# EAGLE design TREM_STM_DAUGHTERBOARD (EAGLE 9.2.2)
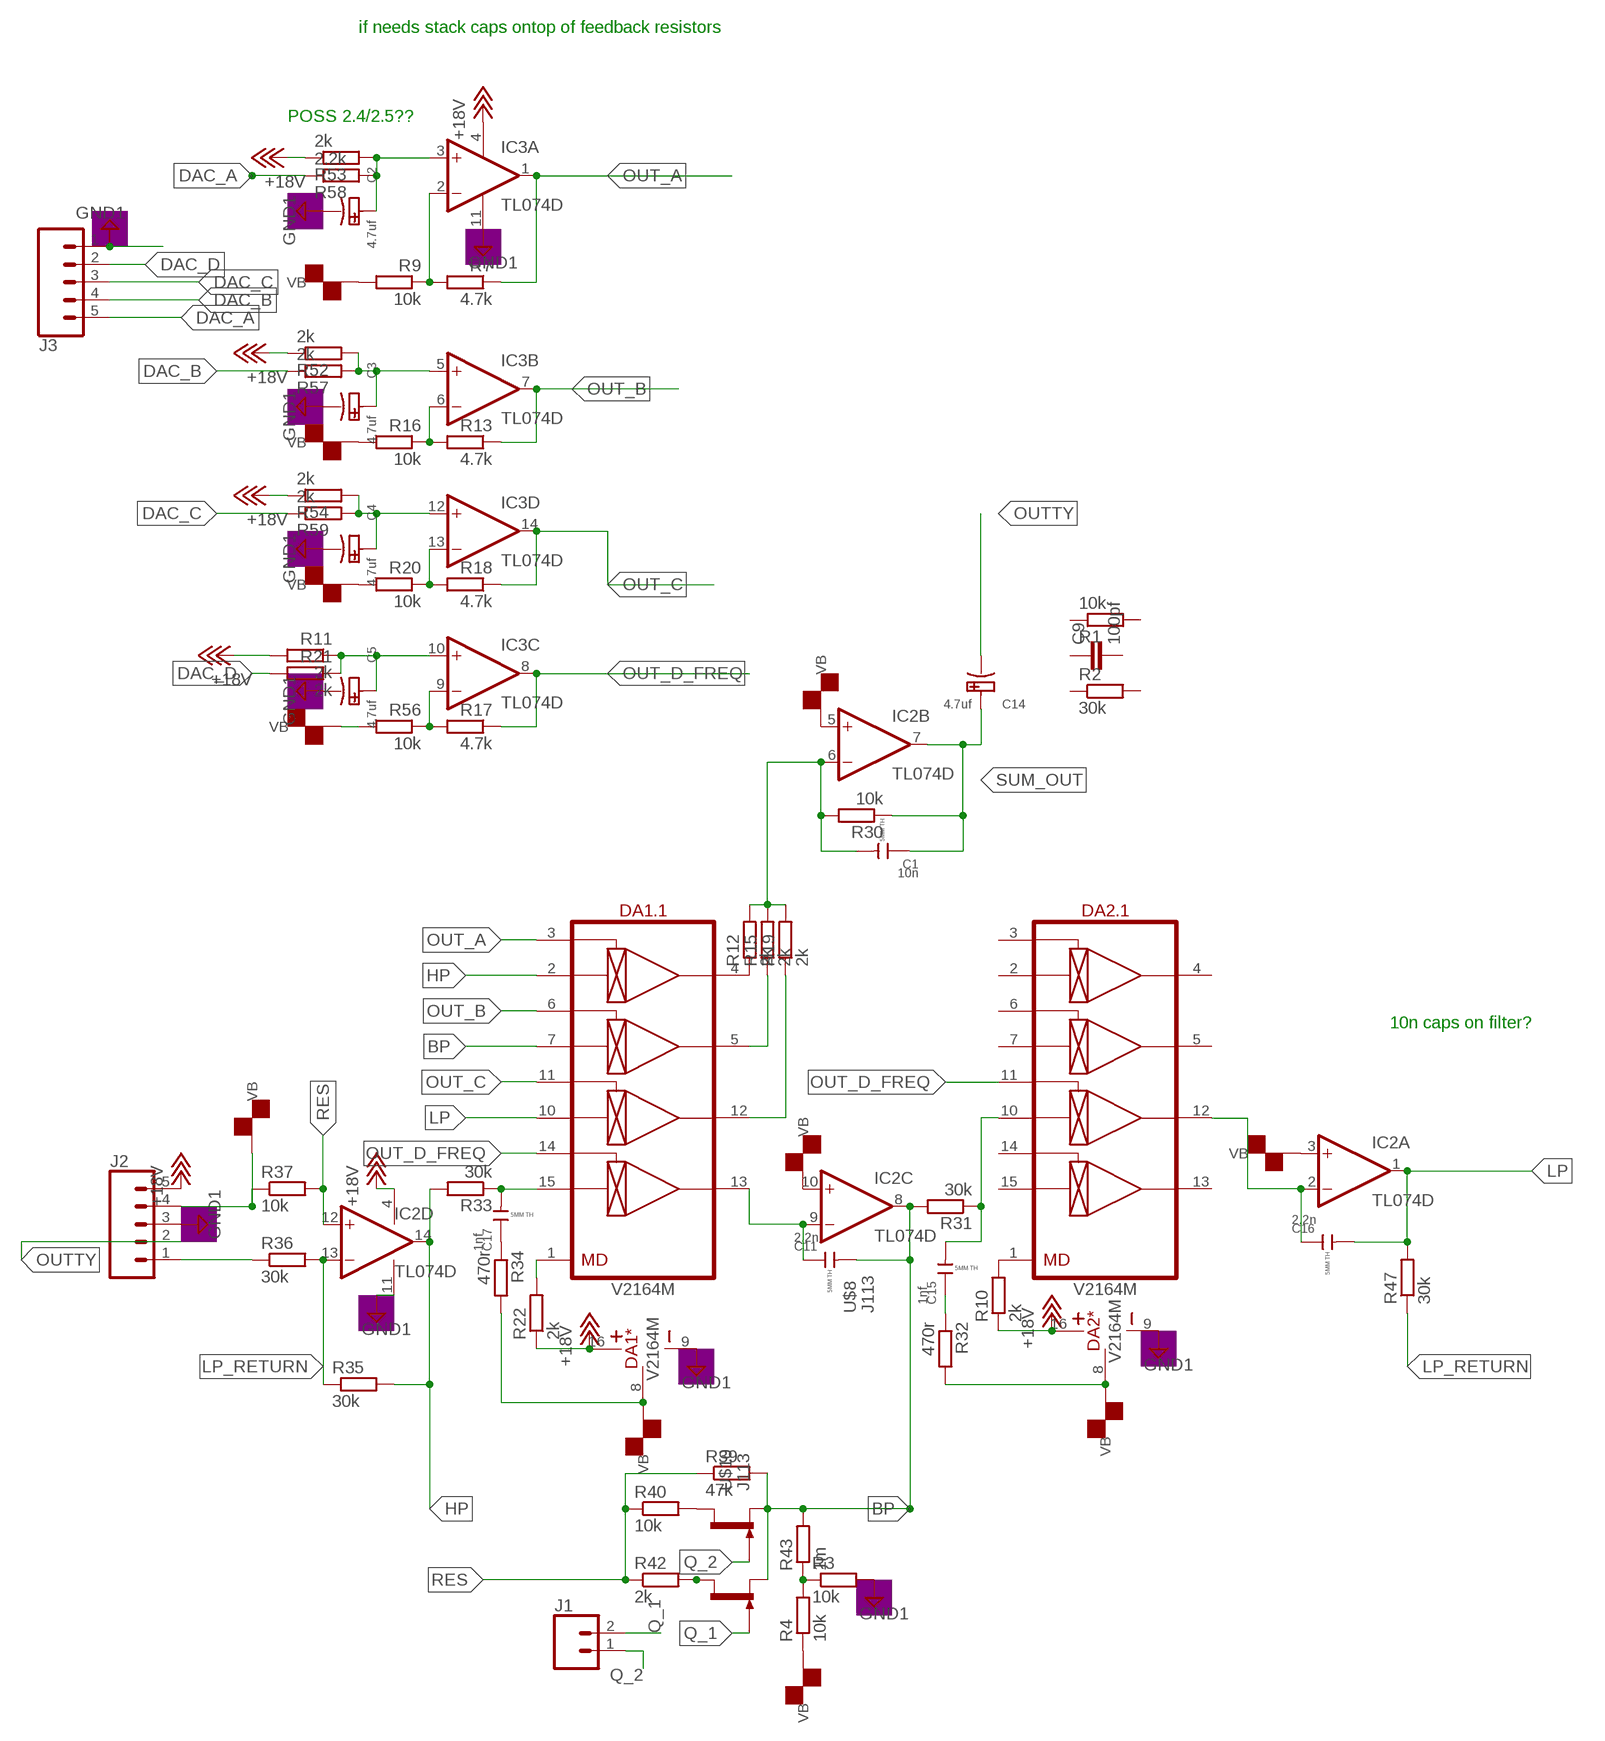
[diagram p0: schematic, sheet 1]

## Parts
C1  10n  THRU_HOLE_5MM_SPACING  [CERAMIC-5MM]
C2  4.7uf  THRU-HOLE-POLARIZED  [PC-D5.3MM]
C3  4.7uf  THRU-HOLE-POLARIZED  [PC-D5.3MM]
C4  4.7uf  THRU-HOLE-POLARIZED  [PC-D5.3MM]
C5  4.7uf  THRU-HOLE-POLARIZED  [PC-D5.3MM]
C9  100pf  C-EUC1206  [C1206]
C11  2.2n  THRU_HOLE_5MM_SPACING  [CERAMIC-5MM]
C14  4.7uf  THRU-HOLE-POLARIZED  [PC-D5.3MM]
C15  1nf  THRU_HOLE_5MM_SPACING  [CERAMIC-5MM]
C16  2.2n  THRU_HOLE_5MM_SPACING  [CERAMIC-5MM]
C17  1nf  THRU_HOLE_5MM_SPACING  [CERAMIC-5MM]
DA1  V2164M  [SO-16]
DA2  V2164M  [SO-16]
IC2  TL074D  [SO14]
IC3  TL074D  [SO14]
J1  CONN_02PTH3  [1X02_LONGPADS]
J2  CONN_05PTH_LONGPADS  [1X05_LONGPADS]
J3  CONN_05PTH_LONGPADS  [1X05_LONGPADS]
R1  10k  R-EU_M1206  [M1206]
R2  30k  R-EU_M1206  [M1206]
R3  10k  R-EU_M1206  [M1206]
R4  10k  R-EU_M1206  [M1206]
R7  4.7k  R-EU_M1206  [M1206]
R9  10k  R-EU_M1206  [M1206]
R10  2k  R-EU_M1206  [M1206]
R11  2k  R-EU_M1206  [M1206]
R12  2k  R-EU_M1206  [M1206]
R13  4.7k  R-EU_M1206  [M1206]
R15  2k  R-EU_M1206  [M1206]
R16  10k  R-EU_M1206  [M1206]
R17  4.7k  R-EU_M1206  [M1206]
R18  4.7k  R-EU_M1206  [M1206]
R19  2k  R-EU_M1206  [M1206]
R20  10k  R-EU_M1206  [M1206]
R21  2k  R-EU_M1206  [M1206]
R22  2k  R-EU_M1206  [M1206]
R30  10k  R-EU_M1206  [M1206]
R31  30k  R-EU_M1206  [M1206]
R32  470r  R-EU_M1206  [M1206]
R33  30k  R-EU_M1206  [M1206]
R34  470r  R-EU_M1206  [M1206]
R35  30k  R-EU_M1206  [M1206]
R36  30k  R-EU_M1206  [M1206]
R37  10k  R-EU_M1206  [M1206]
R39  47k  R-EU_M1206  [M1206]
R40  10k  R-EU_M1206  [M1206]
R42  2k  R-EU_M1206  [M1206]
R43  1m  R-EU_M1206  [M1206]
R47  30k  R-EU_M1206  [M1206]
R52  2k  R-EU_M1206  [M1206]
R53  2k  R-EU_M1206  [M1206]
R54  2k  R-EU_M1206  [M1206]
R56  10k  R-EU_M1206  [M1206]
R57  2k  R-EU_M1206  [M1206]
R58  2.2k  R-EU_M1206  [M1206]
R59  2k  R-EU_M1206  [M1206]
U$8  J113  J111  [TO92-]
U$10  J113  J111  [TO92-]

## Nets
+18V: DA1.16(*:V+) DA2.16(*:V+) IC2.4(P:V+) IC3.4(P:V+) J2.5 R10.1 R11.2 R22.1 R52.1 R53.1 R54.1
BP: C11.2 DA1.7(.1:IN2) IC2.8(C:OUT) R31.2 R39.2 R43.2 U$8.2(S) U$10.2(S)
DAC_A: J3.5 R58.1
DAC_B: J3.4 R57.1
DAC_C: J3.3 R59.1
DAC_D: J3.2 R21.2
GND1: C2.- C3.- C4.- C5.- DA1.9(*:V-) DA2.9(*:V-) IC2.11(P:V-) IC3.11(P:V-) J2.3 J3.1 R3.2
HP: DA1.2(.1:IN1) IC2.14(D:OUT) R33.2 R35.2
LP: C16.2 DA1.10(.1:IN3) IC2.1(A:OUT) R47.2
LP_RETURN: IC2.13(D:-IN) R35.1 R36.2 R47.1
N$1: IC3.2(A:-IN) R7.2 R9.1
N$2: R3.1 R4.2 R43.1
N$3: DA1.1(.1:MD) R22.2
N$4: C2.+ IC3.3(A:+IN) R53.2 R58.2
N$5: C3.+ IC3.5(B:+IN) R52.2 R57.2
N$6: IC3.6(B:-IN) R13.2 R16.1
N$7: DA2.1(.1:MD) R10.2
N$8: C4.+ IC3.12(D:+IN) R54.2 R59.2
N$9: C5.+ IC3.10(C:+IN) R11.1 R21.1
N$10: IC3.13(D:-IN) R18.2 R20.1
N$11: DA1.4(.1:OUT1) R12.1
N$13: IC3.9(C:-IN) R17.2 R56.1
N$14: DA1.5(.1:OUT2) R15.1
N$15: DA1.12(.1:OUT3) R19.1
N$21: C1.2 IC2.6(B:-IN) R12.2 R15.2 R19.2 R30.2
N$23: J2.1 R36.1
N$24: C11.1 DA1.13(.1:OUT4) IC2.9(C:-IN)
N$25: R40.2 U$10.3(D)
N$26: C15.2 DA2.10(.1:IN3) R31.1
N$27: C15.1 R32.1
N$28: C16.1 DA2.12(.1:OUT3) IC2.2(A:-IN)
N$29: R42.2 U$8.3(D)
N$30: C17.2 DA1.15(.1:IN4) R33.1
N$42: C17.1 R34.1
OUT_A: DA1.3(.1:CV1) IC3.1(A:OUT) R7.1
OUT_B: DA1.6(.1:CV2) IC3.7(B:OUT) R13.1
OUT_C: DA1.11(.1:CV3) IC3.14(D:OUT) R18.1
OUT_D_FREQ: DA1.14(.1:CV4) DA2.11(.1:CV3) IC3.8(C:OUT) R17.1
OUTTY: C14.- J2.2
Q_1: J1.2 U$8.1(G)
Q_2: J1.1 U$10.1(G)
RES: IC2.12(D:+IN) R37.2 R39.1 R40.1 R42.1
SUM_OUT: C1.1 C14.+ IC2.7(B:OUT) R30.1
VB: DA1.8(*:GND) DA2.8(*:GND) IC2.3(A:+IN) IC2.5(B:+IN) IC2.10(C:+IN) J2.4 R4.1 R9.2 R16.2 R20.2 R32.2 R34.2 R37.1 R56.2
Unconnected: C9.1 C9.2 DA2.2(.1:IN1) DA2.3(.1:CV1) DA2.4(.1:OUT1) DA2.5(.1:OUT2) DA2.6(.1:CV2) DA2.7(.1:IN2) DA2.13(.1:OUT4) DA2.14(.1:CV4) DA2.15(.1:IN4) R1.1 R1.2 R2.1 R2.2

## Notes on the sheet
- if needs stack caps ontop of feedback resistors
- POSS 2.4/2.5??
- 10n caps on filter?

## Library data of the parts
C1 C11 C15-C17 = GT_Capacitor:THRU_HOLE_5MM_SPACING: 302010202; PACKAGE: 5MM TH
C2-C5 C14 = GT_Capacitor:THRU-HOLE-POLARIZED: 302030033; PACKAGE: TH
C9 = resistor:C-EU: CAPACITOR, European symbol
DA1 DA2 = ic-coolaudio:V2164
IC2 IC3 = linear:TL074: OP AMP
J1 = GT_Connectors:CONN_02: Multi connection point. Often used as Generic Header-pin footprint for 0.1 inch spaced/style header connections On any of the 0.1 inch spaced packages, you can populate with these: Break Away Headers - Straight <https://www.sparkfun.com/products/116> (PRT-00116) Break Away Male Headers - Right Angle <https://www.sparkfun.com/products/553> (PRT-00553) Female Headers <https://www.sparkfun.com/products/115> (PRT-00115) Break Away Headers - Machine Pin <https://www.sparkfun.com/products/117> (PRT-00117) Break Away Female Headers - Swiss Machine Pin <https://www.sparkfun.com/products/743> (PRT-00743) For SCREWTERMINALS and SPRING TERMINALS visit here: Screw Terimnals on SparkFun.com <https://www.sparkfun.com/search/results?term=Screw+Terminals> (5mm/3.5mm/2.54mm spacing) This device is also useful as a general connection point to wire up your design to another part of your project. Our various solder wires solder well into these plated through hole pads. Hook-Up Wire - Assortment (Stranded, 22 AWG) <https://www.sparkfun.com/products/11375> (PRT-11375) Hook-Up Wire - Assortment (Solid Core, 22 AWG) <https://www.sparkfun.com/products/11367> (PRT-11367) View the entire wire category on our website here <https://www.sparkfun.com/categories/141> Special notes: Molex polarized connector foot print use with: PRT-08233 with associated crimp pins and housings. 2.54_SCREWTERM for use with PRT-10571. 3.5mm Screw Terminal footprints for PRT-08084 5mm Screw Terminal footprints for use with PRT-08432
J2 J3 = GT_Connectors:CONN_05: Multi connection point. Often used as Generic Header-pin footprint for 0.1 inch spaced/style header connections On any of the 0.1 inch spaced packages, you can populate with these: Break Away Headers - Straight <https://www.sparkfun.com/products/116> (PRT-00116) Break Away Male Headers - Right Angle <https://www.sparkfun.com/products/553> (PRT-00553) Female Headers <https://www.sparkfun.com/products/115> (PRT-00115) Break Away Headers - Machine Pin <https://www.sparkfun.com/products/117> (PRT-00117) Break Away Female Headers - Swiss Machine Pin <https://www.sparkfun.com/products/743> (PRT-00743) For SCREWTERMINALS and SPRING TERMINALS visit here: Screw Terimnals on SparkFun.com <https://www.sparkfun.com/search/results?term=Screw+Terminals> (5mm/3.5mm/2.54mm spacing) This device is also useful as a general connection point to wire up your design to another part of your project. Our various solder wires solder well into these plated through hole pads. Hook-Up Wire - Assortment (Stranded, 22 AWG) <https://www.sparkfun.com/products/11375> (PRT-11375) Hook-Up Wire - Assortment (Solid Core, 22 AWG) <https://www.sparkfun.com/products/11367> (PRT-11367) View the entire wire category on our website here <https://www.sparkfun.com/categories/141> Special notes: Molex polarized connector foot print use with SKU : PRT-08231 with associated crimp pins and housings. 1MM SMD Version SKU: PRT-10208
R1-R4 R7 R9-R13 R15-R22 R30-R37 R39 R40 R42 R43 R47 R52-R54 R56-R59 = resistor:R-EU_: RESISTOR, European symbol
U$8 U$10 = fv1_bingo:J111

## Board
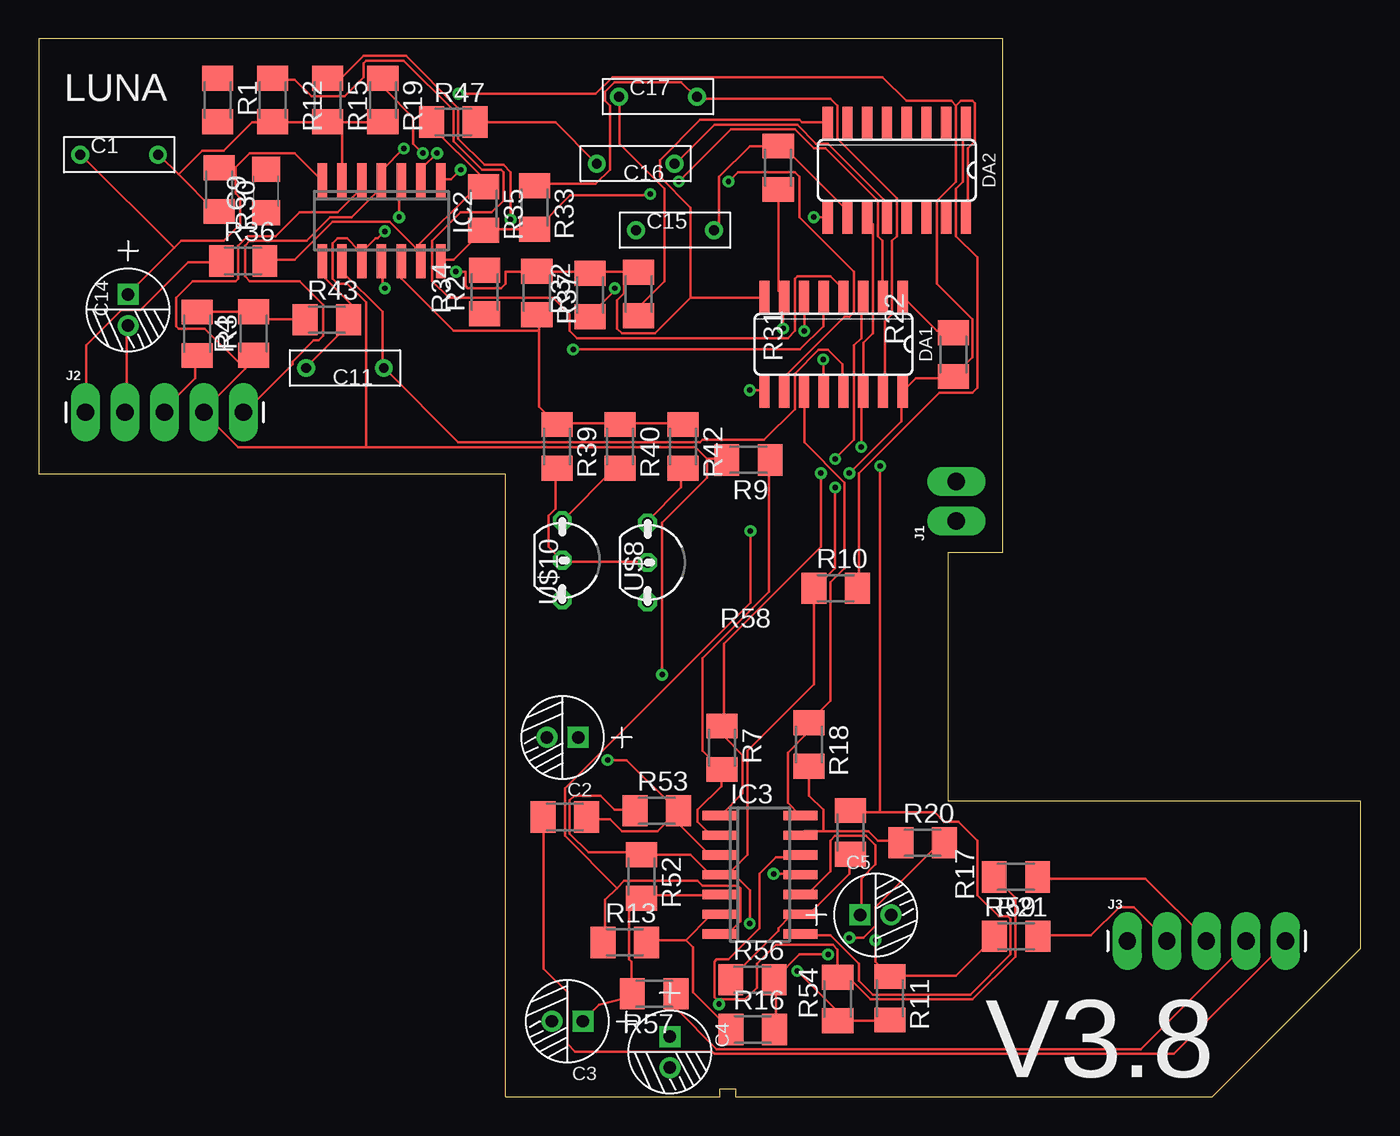
[diagram p1: board, top side]
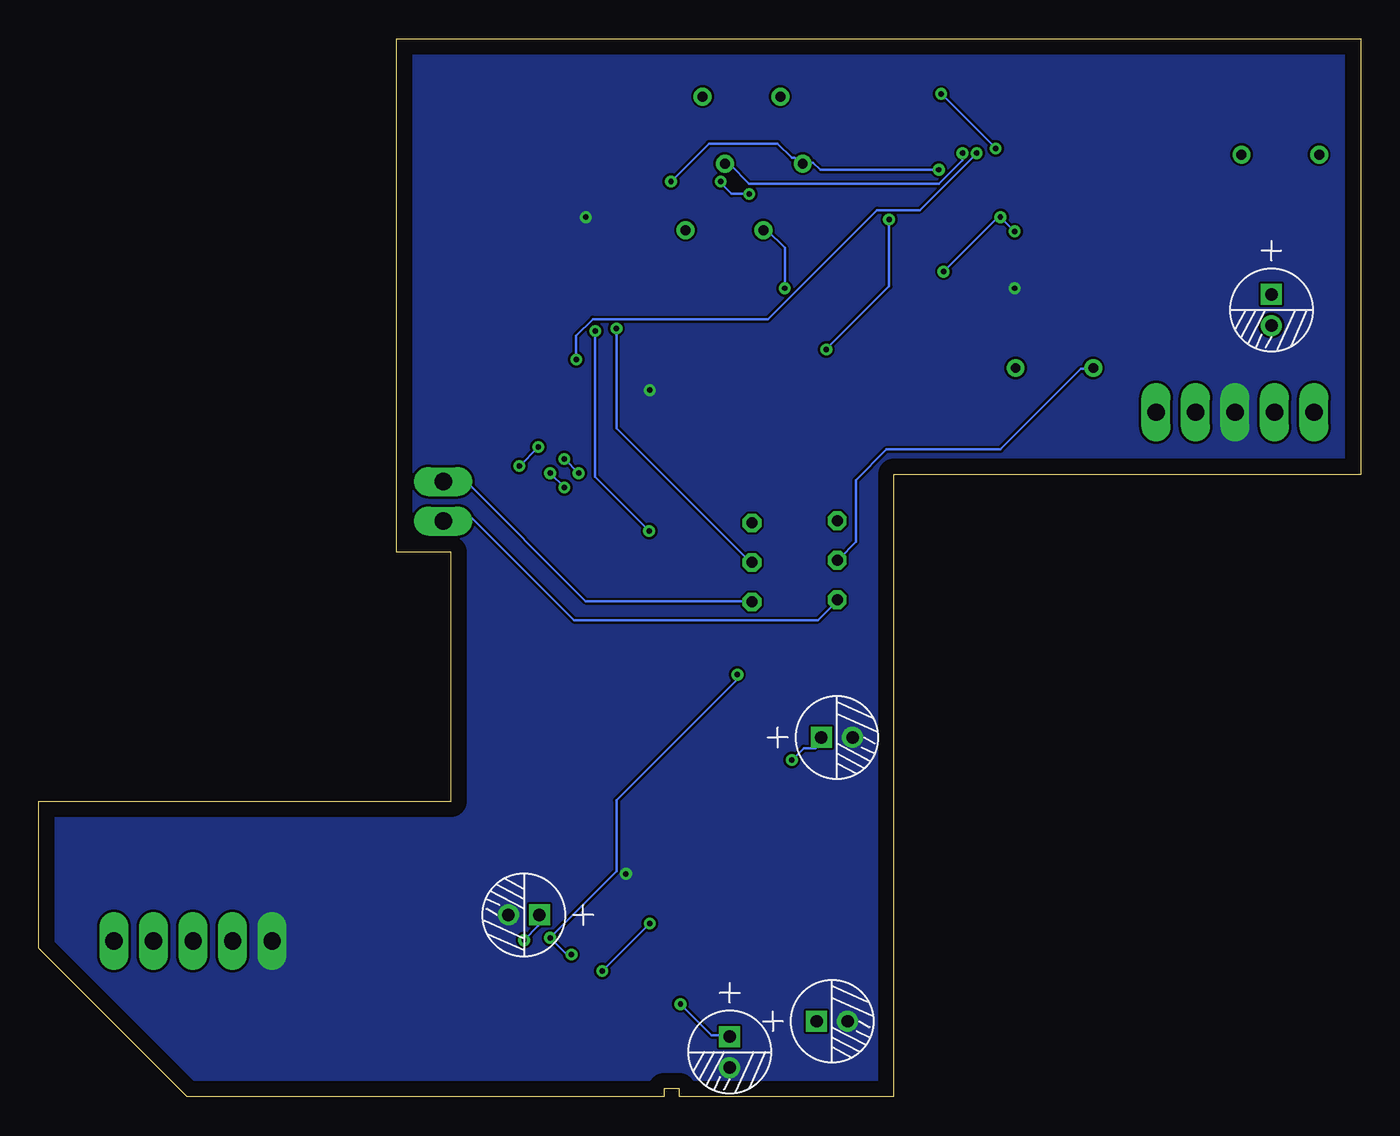
[diagram p2: board, bottom side, seen from below]

Size 85 x 68 mm. Coordinates in mm from the lower left corner, seen from the top.
Outline: 62,68 0,68 0,40 30,40 30,0 43.8,0 43.8,0.5 44.8,0.5 44.8,0 75.46,0 85,9.54 85,19 58.5,19 58.5,35 62,35 62,68
Copper layers (1*16): Top 0.035mm / dielectric 1.5mm / Bottom 0.035mm
Design rules "default": minimum track width 6mil, minimum drill 0.35mm, track to track 6mil, track to pad 6mil, pad to pad 6mil, via to via 6mil, smd to smd 6mil, copper to edge 40mil, drill to drill 6mil, minimum pad ring 10mil, minimum via ring 8mil, stop-mask expansion 4mil, vias tented up to drill 0mil, thermal gap 10mil

### Footprints (pad centres in the part's own frame; a part is rotated, then mirrored left to right if it is on the bottom)
CERAMIC-5MM = drill 0.635 pad 1.143: 1 -2.5,0; 2 2.5,0
PC-D5.3MM = drill 0.8 pad 1.35 square: + -1,0 | drill 0.8 pad 1.35: - 1,0
C1206 = smd 1.6 x 1.8: 1 -1.4,0; 2 1.4,0
SO-16 = smd 0.66 x 2.032: 1 -4.445,-3.073; 2 -3.175,-3.073; 3 -1.905,-3.073; 4 -0.635,-3.073; 5 0.635,-3.073; 6 1.905,-3.073; 7 3.175,-3.073; 8 4.445,-3.073; 9 4.445,3.073; 10 3.175,3.073; 11 1.905,3.073; 12 0.635,3.073; 13 -0.635,3.073; 14 -1.905,3.073; 15 -3.175,3.073; 16 -4.445,3.073
SO14 = smd 0.6 x 2.2: 1 -3.81,-2.6; 2 -2.54,-2.6; 3 -1.27,-2.6; 4 0,-2.6; 5 1.27,-2.6; 6 2.54,-2.6; 7 3.81,-2.6; 8 3.81,2.6; 9 2.54,2.6; 10 1.27,2.6; 11 0,2.6; 12 -1.27,2.6; 13 -2.54,2.6; 14 -3.81,2.6
1X02_LONGPADS = drill 1.118 pad 1.88 long: 1 0,0; 2 2.54,0
1X05_LONGPADS = drill 1.118 pad 1.88 long: 1 0,0; 2 2.54,0; 3 5.08,0; 4 7.62,0; 5 10.16,0
M1206 = smd 1.6 x 2: 1 -1.4,0; 2 1.4,0
TO92- = drill 0.7 octagon: 1 2.54,0; 2 0,0; 3 -2.54,0

### Placement (x,y rotation side)
C1  5.16,60.56 0 top
C2  33.68,23.1 180 top
C3  33.99,4.85 180 top
C4  40.58,2.86 270 top
C5  53.8,11.69 0 top
C9  14.6,58.21 90 top
C11  19.69,46.84 180 top
C14  5.74,50.57 270 top
C15  40.91,55.7 0 top
C16  38.38,59.98 180 top
C17  39.82,64.29 0 top
DA1  51.11,48.37 180 top
DA2  55.17,59.56 180 top
IC2  22.03,56.31 180 top
IC3  46.37,14.27 270 top
J1  59,37 90 top
J2  3,44 0 top
J3  70,10 0 top
R1  11.49,64.07 270 top
R2  28.66,51.73 90 top
R3  10.19,49.05 270 top
R4  13.8,49.06 90 top
R7  43.94,22.43 270 top
R9  45.63,40.93 180 top
R10  51.25,32.7 0 top
R11  54.72,6.33 270 top
R12  15.04,64.07 270 top
R13  37.68,9.91 0 top
R15  18.58,64.07 270 top
R16  45.9,4.32 0 top
R17  52.19,16.99 270 top
R18  49.52,22.65 270 top
R19  22.12,64.07 270 top
R20  56.83,16.32 0 top
R21  62.85,10.3 0 top
R22  58.81,47.7 90 top
R30  11.6,58.31 270 top
R31  47.54,59.72 270 top
R32  35.44,51.54 90 top
R33  31.87,57.15 270 top
R34  38.56,51.59 90 top
R35  28.6,57.09 270 top
R36  13.14,53.72 0 top
R37  32.02,51.66 270 top
R39  33.32,41.81 270 top
R40  37.37,41.81 270 top
R42  41.43,41.81 270 top
R43  18.52,49.95 0 top
R47  26.66,62.66 0 top
R52  38.76,14.15 270 top
R53  39.74,18.39 0 top
R54  51.37,6.27 90 top
R56  45.89,7.51 0 top
R57  39.56,6.6 180 top
R58  33.83,17.98 0 top
R59  62.83,14.12 180 top
U$8  39.14,34.34 270 top
U$10  33.65,34.48 270 top

### Tracks (layer width: path | path; a pad name or v marks a point on that pad's centre or on a via)
+18V  (via drill 0.35)
  Top 0.152: 21.95,58.37 21.95,58.83 IC2.4 | 58.98,63.7 59.28,64.01 60.05,64.01 60.2,63.86 60.2,61.42 59.74,60.96 59.74,56.54 DA2.16 | 58.98,63.7 58.98,58.83 57.76,57.61 57.76,52.27 60.05,49.99 60.05,47.55 58.83,46.33 R22.1 58.67,46.18 56.39,46.18 55.63,45.41 DA1.16 55.47,45.26 55.47,43.43 v52.12,40.08 | R11.2 54.71,4.88 51.51,4.88 R54.1 51.36,5.49 v48.77,8.08 | IC3.4 43.74,14.33 43.13,14.33 41.91,15.54 38.86,15.54 R52.1 38.71,15.7 35.36,15.7 34.14,16.92 34.14,19.05 34.44,19.36 36.12,19.36 37.03,18.44 38.25,18.44 R53.1 | 44.5,14.48 44.35,14.33 43.89,14.33 IC3.4 | 44.5,14.48 45.57,15.54 45.57,22.25 49.84,26.52 49.84,32.61 R10.1 49.99,32.77 51.21,33.98 v51.21,39.17 | v45.72,11.12 45.72,13.26 44.5,14.48 | 44.5,14.48 IC3.4 | v23.47,60.96 22.1,59.59 22.1,58.98 IC2.4 | v26.98,64.47 35.81,64.47 36.88,65.53 54.25,65.53 55.78,64.01 58.67,64.01 58.98,63.7 | 21.95,58.37 20.12,56.54 18.75,56.54 17.22,55.02 13.56,55.02 13.26,54.71 13.26,52.73 13.56,52.43 16.76,52.43 18.29,50.9 18.29,48.92 17.98,48.62 17.68,48.62 16.31,47.24 16.31,47.09 13.26,44.04 J2.5 | 21.95,58.37 IC2.4
  Bottom 0.152: v45.72,11.12 v48.77,8.08 | v51.21,39.17 v52.12,40.08 | v26.98,64.47 v23.47,60.96
BP  (via drill 0.35)
  Top 0.152: 20.29,50.35 R43.2 | 18.14,53.65 IC2.8 18.29,53.65 18.29,52.73 20.27,50.75 20.27,50.29 R43.2 | R31.2 47.55,58.22 47.55,51.82 47.85,51.51 DA1.7 47.85,51.36 v47.85,49.38 | R39.2 33.22,40.39 33.22,37.8 32.77,37.34 32.77,35.36 33.53,34.59 U$10.2 33.85,34.28 33.99,34.38 39.09,34.38 U$8.2 | R43.2 19.81,49.84 19.81,49.53 17.22,46.94 C11.2
  Bottom 0.152: v47.85,49.38 47.85,42.98 39.17,34.29 U$8.2 | C11.2 17.22,46.79 17.98,46.79 23.16,41.6 30.48,41.6 32.46,39.62 32.46,35.66 33.53,34.59 U$10.2
DAC_A
  Top 0.152: R58.1 32.46,17.83 32.46,8.23 33.98,6.71 33.98,3.39 34.48,2.9 43.28,2.9 43.43,2.74 73,2.74 80.16,9.91 J3.5
DAC_B
  Top 0.152: J3.4 77.72,9.91 70.87,3.05 43.59,3.05 41,5.64 41,6.55 R57.1
DAC_C
  Top 0.152: R59.1 64.31,14.02 71.17,14.02 75.13,10.06 J3.3
DAC_D
  Top 0.152: R21.2 64.31,10.36 67.67,10.36 69.49,12.19 70.41,12.19 72.54,10.06 J3.2
GND1  (via drill 0.35)
  Top 0.152: v45.72,45.41 46.63,45.41 DA1.9 | v49.84,56.54 50.6,56.54 DA2.9 | v47.24,14.33 48.92,14.33 IC3.11 | v22.25,51.97 22.1,52.12 22.1,53.65 IC2.11 | R3.2 10.06,47.55 10.06,46.18 8.23,44.35 8.23,44.04 J2.3
  pour Bottom (no thermals): -7.52,85.02 -7.52,-4.18 96.25,-4.18 96.25,85.02
HP  (via drill 0.35)
  Top 0.152: v41.15,58.83 44.5,62.18 48.62,62.18 49.84,60.96 50.6,60.96 53.95,57.61 53.95,55.32 54.25,55.02 54.25,51.51 DA1.2 | v39.32,58.03 39.23,57.94 34.17,57.94 32,55.78 R33.2 31.85,55.78 28.65,55.78 R35.2 28.5,55.63 26.67,53.8 25.91,53.8 IC2.14
  Bottom 0.152: v39.32,58.03 40.46,58.03 41.17,58.75 41.17,58.8 v41.15,58.83
LP  (via drill 0.35)
  Top 0.152: R47.2 28.19,62.64 33.22,62.64 35.81,60.05 C16.2 | v44.35,58.83 44.96,59.44 48.62,59.44 48.92,59.13 48.92,56.54 52.43,53.03 52.43,50.44 52.12,50.14 51.82,50.14 48.01,46.33 48.01,45.41 DA1.10 | v27.13,59.59 26.52,58.98 25.91,58.98 IC2.1
  Bottom 0.152: v44.35,58.83 41.91,61.27 37.49,61.27 36.58,60.35 36.42,60.35 35.97,59.89 C16.2 35.81,60.05 35.2,60.05 34.75,59.59 v27.13,59.59
LP_RETURN
  Top 0.152: R47.1 25.3,62.64 25.3,62.33 28.5,59.13 28.5,58.52 R35.1 28.5,58.37 28.04,58.37 24.23,54.56 | 24.23,54.56 24.54,54.25 24.54,53.8 IC2.13 | 24.23,54.56 22.55,56.24 18.9,56.24 16.46,53.8 14.63,53.8 R36.2
N$1
  Top 0.152: IC3.2 43.74,16.92 43.13,16.92 42.37,17.68 42.37,18.44 43.89,19.96 43.89,20.88 R7.2 43.89,21.03 42.67,22.25 42.67,28.19 46.94,32.46 46.94,40.84 R9.1
N$2
  Top 0.152: R3.1 10.21,50.44 13.72,50.44 R4.2 13.87,50.44 14.33,49.99 17.07,49.99 R43.1
N$3
  Top 0.152: R22.2 58.67,49.23 57.76,49.23 55.63,51.36 DA1.1
N$4  (via drill 0.35)
  Top 0.152: 40.69,17.98 41,18.29 R53.2 | 40.69,17.98 39.78,17.07 37.49,17.07 36.73,17.83 35.36,17.83 R58.2 | 40.69,17.98 43.13,15.54 43.74,15.54 IC3.3 | 40.69,17.98 R53.2 | v36.58,21.64 37.8,21.64 41,18.44 R53.2
  Bottom 0.152: v36.58,21.64 35.81,22.4 35.06,22.4 C2.+
N$5
  Top 0.152: IC3.5 43.74,12.95 39.01,12.95 38.86,12.8 R52.2 38.71,12.65 37.95,11.89 37.95,8.84 38.1,8.69 38.1,6.71 R57.2 38.1,6.55 37.95,6.4 36.04,5.9 C3.+
N$6
  Top 0.152: 41.6,10.06 39.17,10.06 R13.2 | 41.6,10.06 43.13,11.58 43.74,11.58 IC3.6 | 44.5,4.88 44.5,4.42 R16.1 44.5,4.88 | 41.6,10.06 42.06,9.6 42.06,6.71 43.89,4.88 44.5,4.88
N$7
  Top 0.152: R10.2 52.73,32.77 52.73,40.08 57.91,45.26 60.05,45.26 60.35,45.57 60.35,53.95 58.98,55.32 58.98,58.37 59.44,58.83 59.44,62.33 59.59,62.48 DA2.1
N$8  (via drill 0.35)
  Top 0.152: R59.2 61.57,14.02 62.79,12.8 62.79,8.99 60.05,6.25 53.49,6.25 52.12,7.62 51.51,7.62 R54.2 51.36,7.77 51.36,9.45 51.05,9.75 47.4,9.75 46.18,8.53 46.18,7.01 45.41,6.25 43.74,6.25 | 43.74,6.25 43.59,6.25 43.43,6.4 43.43,8.69 43.59,8.84 44.35,8.84 46.33,10.82 46.33,14.33 47.4,15.39 48.92,15.39 IC3.12 | 43.74,6.25 v43.74,5.94
  Bottom 0.152: v43.74,5.94 41.76,3.96 40.69,3.96 C4.+
N$9  (via drill 0.35)
  Top 0.152: R21.1 61.42,10.21 58.98,7.77 54.86,7.77 R11.1 54.71,7.77 53.8,8.69 v53.8,10.06 | IC3.10 49.07,13.11 49.53,13.11 50.9,14.48 50.9,16.46 51.21,16.76 53.19,16.76 53.8,16.15 53.8,14.94 52.88,14.02 52.88,11.73 C5.+
  Bottom 0.152: v53.8,10.06 52.88,10.97 52.88,11.58 C5.+
N$10
  Top 0.152: 50.44,17.07 49.23,17.07 49.07,16.92 IC3.13 | 50.44,17.07 53.34,17.07 53.95,16.46 55.32,16.46 R20.1 | 50.44,17.07 50.44,18.44 49.53,19.36 49.53,21.18 R18.2
N$11
  Top 0.152: R12.1 15.09,65.38 16.46,65.38 17.53,64.31 19.66,64.31 20.88,65.53 20.88,66.45 21.03,66.6 23.47,66.6 26.67,63.4 26.67,61.42 28.5,59.59 29.72,59.59 29.87,59.44 29.87,57.61 29.11,56.84 27.13,56.84 25.3,55.02 25.3,52.43 26.36,51.36 33.07,51.36 34.14,50.29 34.14,49.23 34.59,48.77 48.16,48.77 48.62,49.23 48.62,52.58 48.77,52.73 50.9,52.73 51.66,51.97 51.66,51.51 DA1.4
N$13
  Top 0.152: R56.1 44.5,7.62 47.55,10.67 47.55,10.82 48.31,11.58 48.92,11.58 IC3.9 | 49.53,11.73 49.07,11.73 IC3.9 | 49.53,11.73 52.12,14.33 52.12,15.54 R17.2 | 49.53,11.73 IC3.9
N$14  (via drill 0.35)
  Top 0.152: v30.33,56.39 30.33,59.44 29.87,59.89 28.65,59.89 26.98,61.57 26.98,63.55 23.62,66.9 20.88,66.9 19.51,65.53 18.59,65.53 R15.1 | v34.36,48.04 48.95,48.04 50.44,49.53 50.44,51.36 DA1.5
  Bottom 0.152: v34.36,48.04 34.36,48.07 30.33,52.1 v30.33,56.39
N$15  (via drill 0.35)
  Top 0.152: v24.69,60.66 24.08,61.27 24.08,62.94 22.25,64.77 22.25,65.38 R19.1 | v50.44,47.4 50.44,45.41 DA1.12
  Bottom 0.152: v24.69,60.66 28.35,57 31.09,57 38.1,49.99 49.38,49.99 50.44,48.92 v50.44,47.4
N$21
  Top 0.152: R15.2 18.44,62.64 15.09,62.64 R12.2 14.94,62.64 13.72,62.64 11.89,60.81 10.52,60.81 8.99,59.28 | 19.51,62.64 18.59,62.64 R15.2 | 19.51,62.64 22.1,62.64 R19.2 | 19.51,62.64 19.51,58.98 IC2.6 | 19.51,62.64 R15.2 | 8.99,59.28 7.77,60.5 C1.2 | 8.99,59.28 11.28,57 11.58,57 R30.2
N$23
  Top 0.152: R36.1 11.73,53.65 9.6,53.65 6.55,50.6 5.33,50.6 3.05,48.31 3.05,44.04 J2.1
N$24
  Top 0.152: DA1.13 51.66,45.41 51.66,47.09 50.75,48.01 50.14,48.01 48.62,46.48 48.62,44.2 46.63,42.22 42.67,42.22 42.52,42.06 26.98,42.06 22.25,46.79 C11.1 22.1,46.94 22.1,50.44 19.51,53.03 19.51,53.65 IC2.9
N$25
  Top 0.152: R40.2 37.34,40.39 37.03,40.39 33.68,37.03 U$10.3
N$26
  Top 0.152: DA2.10 51.97,56.54 51.97,57 47.85,61.11 R31.1 47.4,61.11 45.72,61.11 43.74,59.13 43.74,55.98 C15.2
N$27  (via drill 0.35)
  Top 0.152: v37.03,51.97 37.03,51.82 35.51,50.29 R32.1
  Bottom 0.152: v37.03,51.97 37.03,54.56 38.18,55.71 C15.1
N$28  (via drill 0.35)
  Top 0.152: DA2.12 54.41,56.54 54.41,57.61 50.75,61.27 49.99,61.27 48.77,62.48 43.43,62.48 41,60.05 C16.1 | v25.6,60.66 24.69,59.74 24.69,58.98 IC2.2
  Bottom 0.152: v25.6,60.66 25.6,60.2 27.13,58.67 39.32,58.67 40.54,59.89 40.84,59.89 C16.1
N$29
  Top 0.152: R42.2 41.3,40.39 41.3,39.17 39.17,37.03 U$8.3
N$30
  Top 0.152: R33.1 32,58.67 35.81,58.67 36.73,59.59 36.73,63.7 36.42,64.01 36.42,64.62 37.03,65.23 41.3,65.23 42.22,64.31 C17.2 42.37,64.16 50.9,64.16 51.36,63.7 51.36,61.57 55.17,57.76 55.17,55.32 54.86,55.02 54.86,50.29 54.41,49.84 54.41,45.41 DA1.15
N$42
  Top 0.152: R34.1 38.71,50.29 38.71,50.9 40.23,52.43 40.23,58.37 37.34,61.27 37.34,64.16 C17.1
OUT_A  (via drill 0.35)
  Top 0.152: IC3.1 43.89,18.14 45.26,19.51 45.26,21.95 44.04,23.16 44.04,23.77 R7.1 44.04,23.93 44.04,29.11 50.29,35.36 v50.29,40.08 | v51.21,41 52.43,42.22 52.43,48.31 52.88,48.77 52.88,51.36 DA1.3
  Bottom 0.152: v50.29,40.08 v51.21,41
OUT_B  (via drill 0.35)
  Top 0.152: 37.19,13.41 37.64,13.87 42.37,13.87 42.67,13.56 44.96,13.56 45.11,13.41 45.11,11.28 44.35,10.52 43.89,10.52 IC3.7 | 37.19,13.41 36.42,12.65 36.42,10.06 R13.1 | v49.23,49.23 49.23,51.36 DA1.6 | v45.76,36.37 45.76,31.74 33.83,19.81 33.83,16.76 37.19,13.41
  Bottom 0.152: v49.23,49.23 49.23,39.84 v45.76,36.37
OUT_C
  Top 0.152: IC3.14 48.92,18.14 48.16,18.9 48.16,22.1 49.38,23.32 49.38,23.93 R18.1 49.53,24.08 50.9,25.45 50.9,33.07 51.82,33.98 51.82,39.47 49.23,42.06 49.23,45.26 DA1.11
OUT_D_FREQ  (via drill 0.35)
  Top 0.152: DA2.11 53.34,56.39 53.65,56.08 53.65,49.07 53.03,48.46 53.03,45.41 DA1.14 52.88,45.26 v52.88,41.76 | 54.1,18.29 57.61,18.29 58.22,17.68 59.13,17.68 60.35,16.46 60.35,12.95 61.72,11.58 62.33,11.58 62.48,11.43 62.48,9.14 59.89,6.55 53.65,6.55 52.73,7.47 52.73,8.53 50.9,10.36 49.07,10.36 IC3.8 | 54.1,18.29 52.27,18.29 R17.1 | 54.1,18.29 v54.1,40.54
  Bottom 0.152: v54.1,40.54 v52.88,41.76
OUTTY
  Top 0.152: C14.- 5.64,49.53 5.64,44.04 J2.2
Q_1
  Bottom 0.152: U$8.1 39.17,31.85 49.84,31.85 57.76,39.78 59.13,39.78 J1.2
Q_2
  Bottom 0.152: U$10.1 33.68,31.85 34.9,30.63 50.6,30.63 57.3,37.34 59.13,37.34 J1.1
RES
  Top 0.152: 32.16,49.23 32.16,44.35 33.22,43.28 R39.1 33.38,43.28 37.34,43.28 R40.1 37.49,43.28 41.3,43.28 R42.1 | 32.16,49.23 32.16,50.14 R37.2 | 32.16,49.23 26.67,49.23 23.32,52.58 23.32,53.65 IC2.12
SUM_OUT
  Top 0.152: 12.65,59.74 11.73,59.74 R30.1 | 12.65,59.74 13.56,60.66 16.46,60.66 18.14,58.98 IC2.7 | 12.65,59.74 12.65,58.06 12.95,57.76 12.95,56.08 11.89,55.02 9.14,55.02 8.69,54.56 | 8.69,54.56 5.79,51.66 C14.+ | 8.69,54.56 2.74,60.5 C1.1
VB  (via drill 0.35)
  Top 0.152: 37.64,53.03 38.56,53.03 R34.2 37.64,53.03 | 37.64,53.03 35.51,53.03 R32.2 35.36,53.03 32.16,53.03 R37.1 32,53.03 30.02,53.03 30.02,52.27 29.72,51.97 27.58,51.97 27.43,52.12 27.43,53.03 v26.82,53.03 | 41.91,51.36 46.63,51.36 DA1.8 | 41.91,51.36 39.62,49.07 37.49,49.07 37.19,49.38 37.19,51.21 37.64,51.66 37.64,53.03 | 41.91,51.36 41.91,57.15 39.93,59.13 39.93,60.2 42.52,62.79 48.92,62.79 49.07,62.64 50.6,62.64 DA2.8 | R16.2 47.4,4.42 47.4,7.47 R56.2 47.4,7.62 48.92,9.14 v50.75,9.14 | 57.91,16.31 58.22,16.31 R20.2 57.91,16.31 | 20.88,53.65 IC2.10 | v23.16,56.54 23.16,58.83 IC2.3 | v22.25,55.63 21.79,55.17 21.64,55.17 20.88,54.41 | 20.88,53.8 IC2.10 | 42.98,41 44.2,41 R9.2 | 42.98,41 42.22,41.76 21.03,41.76 | 21.03,41.76 12.8,41.76 10.67,43.89 J2.4 10.52,44.04 13.26,46.79 | 20.57,54.41 20.88,54.41 | 20.88,54.41 IC2.10 | v40.08,27.13 40.08,36.88 42.98,39.78 42.98,41 | 57.91,16.31 53.8,12.19 53.8,10.97 53.03,10.21 v52.12,10.21 | IC2.5 20.73,58.83 20.73,58.37 19.2,56.84 16.76,56.84 15.24,55.32 13.41,55.32 12.8,54.71 12.8,52.58 12.65,52.43 9.91,52.43 8.84,51.36 8.84,49.53 8.99,49.38 10.67,49.38 13.26,46.79 | 13.26,46.79 13.72,47.24 13.72,47.55 R4.1 | 21.03,41.76 21.03,51.05 19.81,52.27 19.2,52.27 18.9,52.58 18.9,54.86 19.2,55.17 19.81,55.17 20.57,54.41 | 20.57,54.41 IC2.10
  Bottom 0.152: v22.25,55.63 v23.16,56.54 23.32,56.54 v26.82,53.03 | v50.75,9.14 51.05,9.14 v52.12,10.21 47.85,14.48 47.85,19.05 40.08,26.82 v40.08,27.13

### Text on the board
tPlace: LUNA | V3.8